# EasyEDA Pro project ProProject_TauKeyboard_2023-12-09.epro

# Schematic 61key
Create Date: 2023-12-01; Page Name: P1; Project Name: TauKeyboard; Schematic Name: 61key; Update Date: 2023-12-06; Company: 嘉立创EDA; Page Size: A3; Version: V1.0
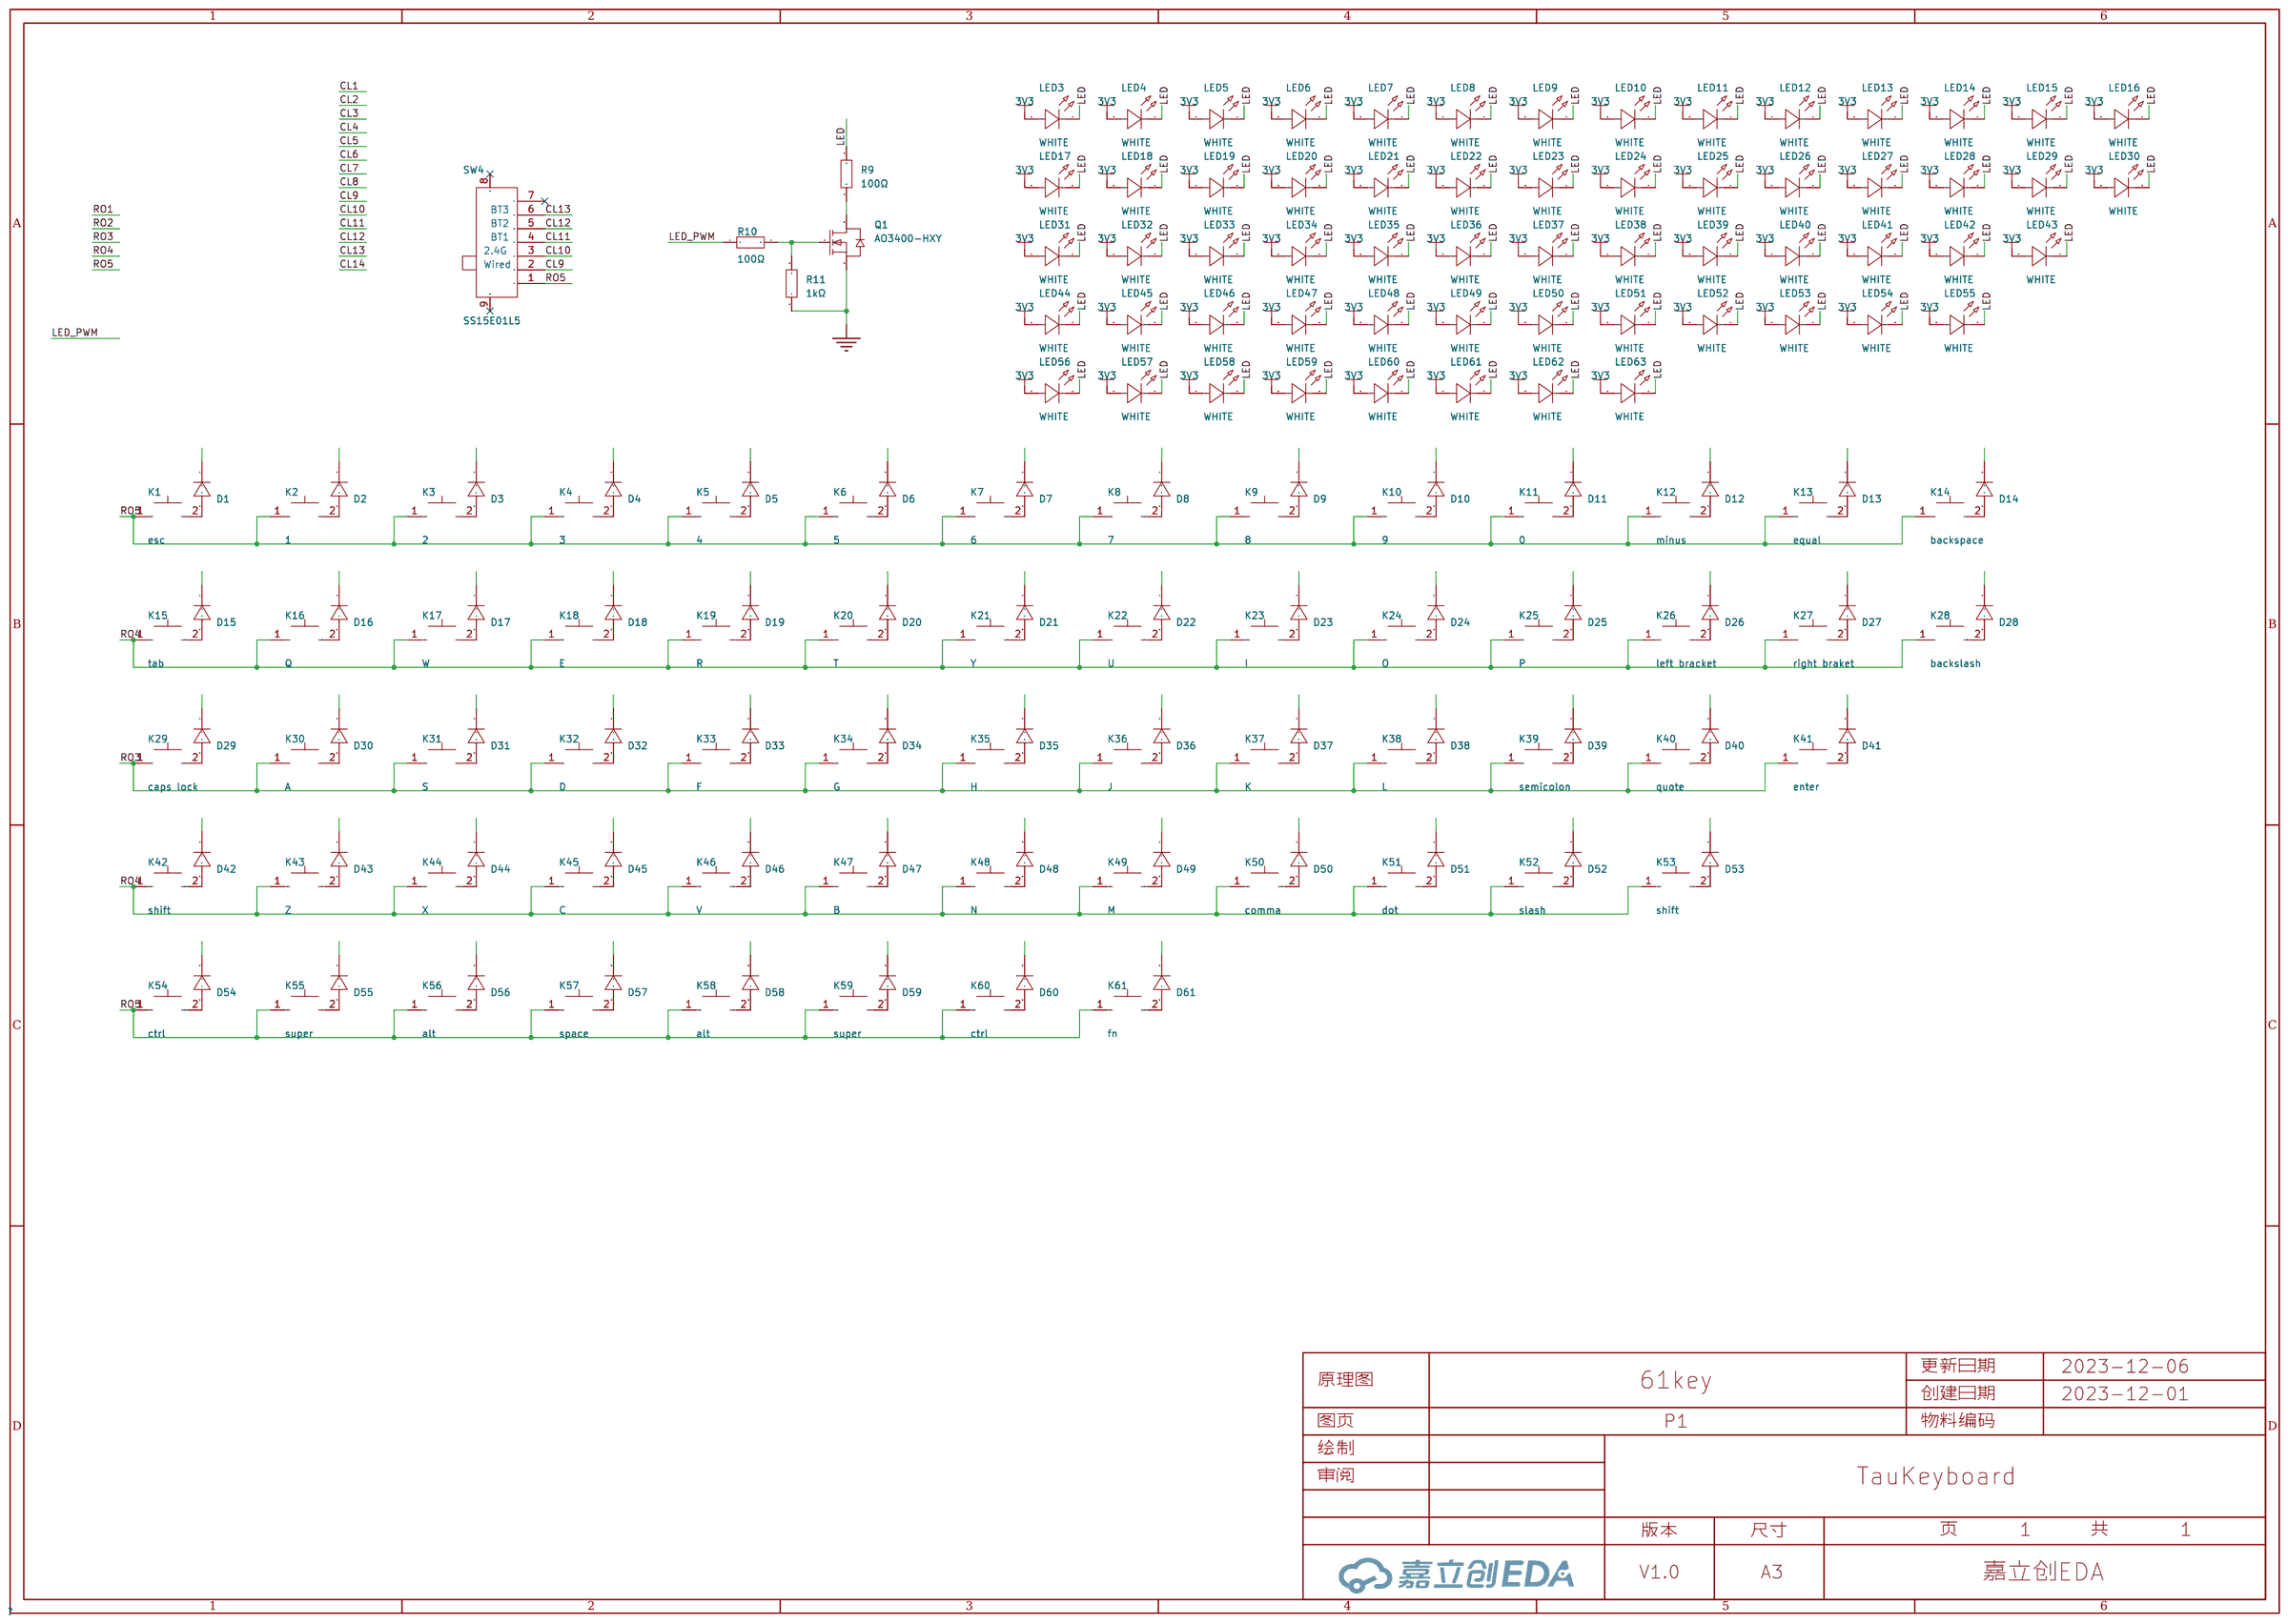
[diagram p0: schematic sheet]

## Parts
CBB1  -
D1  1N4148WS  [SOD-323_L1.8-W1.3-LS2.5-RD]
D2  1N4148WS  [SOD-323_L1.8-W1.3-LS2.5-RD]
D3  1N4148WS  [SOD-323_L1.8-W1.3-LS2.5-RD]
D4  1N4148WS  [SOD-323_L1.8-W1.3-LS2.5-RD]
D5  1N4148WS  [SOD-323_L1.8-W1.3-LS2.5-RD]
D6  1N4148WS  [SOD-323_L1.8-W1.3-LS2.5-RD]
D7  1N4148WS  [SOD-323_L1.8-W1.3-LS2.5-RD]
D8  1N4148WS  [SOD-323_L1.8-W1.3-LS2.5-RD]
D9  1N4148WS  [SOD-323_L1.8-W1.3-LS2.5-RD]
D10  1N4148WS  [SOD-323_L1.8-W1.3-LS2.5-RD]
D11  1N4148WS  [SOD-323_L1.8-W1.3-LS2.5-RD]
D12  1N4148WS  [SOD-323_L1.8-W1.3-LS2.5-RD]
D13  1N4148WS  [SOD-323_L1.8-W1.3-LS2.5-RD]
D14  1N4148WS  [SOD-323_L1.8-W1.3-LS2.5-RD]
D15  1N4148WS  [SOD-323_L1.8-W1.3-LS2.5-RD]
D16  1N4148WS  [SOD-323_L1.8-W1.3-LS2.5-RD]
D17  1N4148WS  [SOD-323_L1.8-W1.3-LS2.5-RD]
D18  1N4148WS  [SOD-323_L1.8-W1.3-LS2.5-RD]
D19  1N4148WS  [SOD-323_L1.8-W1.3-LS2.5-RD]
D20  1N4148WS  [SOD-323_L1.8-W1.3-LS2.5-RD]
D21  1N4148WS  [SOD-323_L1.8-W1.3-LS2.5-RD]
D22  1N4148WS  [SOD-323_L1.8-W1.3-LS2.5-RD]
D23  1N4148WS  [SOD-323_L1.8-W1.3-LS2.5-RD]
D24  1N4148WS  [SOD-323_L1.8-W1.3-LS2.5-RD]
D25  1N4148WS  [SOD-323_L1.8-W1.3-LS2.5-RD]
D26  1N4148WS  [SOD-323_L1.8-W1.3-LS2.5-RD]
D27  1N4148WS  [SOD-323_L1.8-W1.3-LS2.5-RD]
D28  1N4148WS  [SOD-323_L1.8-W1.3-LS2.5-RD]
D29  1N4148WS  [SOD-323_L1.8-W1.3-LS2.5-RD]
D30  1N4148WS  [SOD-323_L1.8-W1.3-LS2.5-RD]
D31  1N4148WS  [SOD-323_L1.8-W1.3-LS2.5-RD]
D32  1N4148WS  [SOD-323_L1.8-W1.3-LS2.5-RD]
D33  1N4148WS  [SOD-323_L1.8-W1.3-LS2.5-RD]
D34  1N4148WS  [SOD-323_L1.8-W1.3-LS2.5-RD]
D35  1N4148WS  [SOD-323_L1.8-W1.3-LS2.5-RD]
D36  1N4148WS  [SOD-323_L1.8-W1.3-LS2.5-RD]
D37  1N4148WS  [SOD-323_L1.8-W1.3-LS2.5-RD]
D38  1N4148WS  [SOD-323_L1.8-W1.3-LS2.5-RD]
D39  1N4148WS  [SOD-323_L1.8-W1.3-LS2.5-RD]
D40  1N4148WS  [SOD-323_L1.8-W1.3-LS2.5-RD]
D41  1N4148WS  [SOD-323_L1.8-W1.3-LS2.5-RD]
D42  1N4148WS  [SOD-323_L1.8-W1.3-LS2.5-RD]
D43  1N4148WS  [SOD-323_L1.8-W1.3-LS2.5-RD]
D44  1N4148WS  [SOD-323_L1.8-W1.3-LS2.5-RD]
D45  1N4148WS  [SOD-323_L1.8-W1.3-LS2.5-RD]
D46  1N4148WS  [SOD-323_L1.8-W1.3-LS2.5-RD]
D47  1N4148WS  [SOD-323_L1.8-W1.3-LS2.5-RD]
D48  1N4148WS  [SOD-323_L1.8-W1.3-LS2.5-RD]
D49  1N4148WS  [SOD-323_L1.8-W1.3-LS2.5-RD]
D50  1N4148WS  [SOD-323_L1.8-W1.3-LS2.5-RD]
D51  1N4148WS  [SOD-323_L1.8-W1.3-LS2.5-RD]
D52  1N4148WS  [SOD-323_L1.8-W1.3-LS2.5-RD]
D53  1N4148WS  [SOD-323_L1.8-W1.3-LS2.5-RD]
D54  1N4148WS  [SOD-323_L1.8-W1.3-LS2.5-RD]
D55  1N4148WS  [SOD-323_L1.8-W1.3-LS2.5-RD]
D56  1N4148WS  [SOD-323_L1.8-W1.3-LS2.5-RD]
D57  1N4148WS  [SOD-323_L1.8-W1.3-LS2.5-RD]
D58  1N4148WS  [SOD-323_L1.8-W1.3-LS2.5-RD]
D59  1N4148WS  [SOD-323_L1.8-W1.3-LS2.5-RD]
D60  1N4148WS  [SOD-323_L1.8-W1.3-LS2.5-RD]
D61  1N4148WS  [SOD-323_L1.8-W1.3-LS2.5-RD]
K1  esc  [SMD_KEYBOARD-SW]
K2  1  [SMD_KEYBOARD-SW]
K3  2  [SMD_KEYBOARD-SW]
K4  3  [SMD_KEYBOARD-SW]
K5  4  [SMD_KEYBOARD-SW]
K6  5  [SMD_KEYBOARD-SW]
K7  6  [SMD_KEYBOARD-SW]
K8  7  [SMD_KEYBOARD-SW]
K9  8  [SMD_KEYBOARD-SW]
K10  9  [SMD_KEYBOARD-SW]
K11  0  [SMD_KEYBOARD-SW]
K12  minus  [SMD_KEYBOARD-SW]
K13  equal  [SMD_KEYBOARD-SW]
K14  backspace  [SMD_KEYBOARD-SW]
K15  tab  [SMD_KEYBOARD-SW]
K16  Q  [SMD_KEYBOARD-SW]
K17  W  [SMD_KEYBOARD-SW]
K18  E  [SMD_KEYBOARD-SW]
K19  R  [SMD_KEYBOARD-SW]
K20  T  [SMD_KEYBOARD-SW]
K21  Y  [SMD_KEYBOARD-SW]
K22  U  [SMD_KEYBOARD-SW]
K23  I  [SMD_KEYBOARD-SW]
K24  O  [SMD_KEYBOARD-SW]
K25  P  [SMD_KEYBOARD-SW]
K26  left bracket  [SMD_KEYBOARD-SW]
K27  right braket  [SMD_KEYBOARD-SW]
K28  backslash  [SMD_KEYBOARD-SW]
K29  caps lock  [SMD_KEYBOARD-SW]
K30  A  [SMD_KEYBOARD-SW]
K31  S  [SMD_KEYBOARD-SW]
K32  D  [SMD_KEYBOARD-SW]
K33  F  [SMD_KEYBOARD-SW]
K34  G  [SMD_KEYBOARD-SW]
K35  H  [SMD_KEYBOARD-SW]
K36  J  [SMD_KEYBOARD-SW]
K37  K  [SMD_KEYBOARD-SW]
K38  L  [SMD_KEYBOARD-SW]
K39  semicolon  [SMD_KEYBOARD-SW]
K40  quote  [SMD_KEYBOARD-SW]
K41  enter  [SMD_KEYBOARD-SW]
K42  shift  [SMD_KEYBOARD-SW]
K43  Z  [SMD_KEYBOARD-SW]
K44  X  [SMD_KEYBOARD-SW]
K45  C  [SMD_KEYBOARD-SW]
K46  V  [SMD_KEYBOARD-SW]
K47  B  [SMD_KEYBOARD-SW]
K48  N  [SMD_KEYBOARD-SW]
K49  M  [SMD_KEYBOARD-SW]
K50  comma  [SMD_KEYBOARD-SW]
K51  dot  [SMD_KEYBOARD-SW]
K52  slash  [SMD_KEYBOARD-SW]
K53  shift  [SMD_KEYBOARD-SW]
K54  ctrl  [SMD_KEYBOARD-SW]
K55  super  [SMD_KEYBOARD-SW]
K56  alt  [SMD_KEYBOARD-SW]
K57  space  [SMD_KEYBOARD-SW]
K58  alt  [SMD_KEYBOARD-SW]
K59  super  [SMD_KEYBOARD-SW]
K60  ctrl  [SMD_KEYBOARD-SW]
K61  fn  [SMD_KEYBOARD-SW]
LED3  WHITE  [LED0603-RD]
LED4  WHITE  [LED0603-RD]
LED5  WHITE  [LED0603-RD]
LED6  WHITE  [LED0603-RD]
LED7  WHITE  [LED0603-RD]
LED8  WHITE  [LED0603-RD]
LED9  WHITE  [LED0603-RD]
LED10  WHITE  [LED0603-RD]
LED11  WHITE  [LED0603-RD]
LED12  WHITE  [LED0603-RD]
LED13  WHITE  [LED0603-RD]
LED14  WHITE  [LED0603-RD]
LED15  WHITE  [LED0603-RD]
LED16  WHITE  [LED0603-RD]
LED17  WHITE  [LED0603-RD]
LED18  WHITE  [LED0603-RD]
LED19  WHITE  [LED0603-RD]
LED20  WHITE  [LED0603-RD]
LED21  WHITE  [LED0603-RD]
LED22  WHITE  [LED0603-RD]
LED23  WHITE  [LED0603-RD]
LED24  WHITE  [LED0603-RD]
LED25  WHITE  [LED0603-RD]
LED26  WHITE  [LED0603-RD]
LED27  WHITE  [LED0603-RD]
LED28  WHITE  [LED0603-RD]
LED29  WHITE  [LED0603-RD]
LED30  WHITE  [LED0603-RD]
LED31  WHITE  [LED0603-RD]
LED32  WHITE  [LED0603-RD]
LED33  WHITE  [LED0603-RD]
LED34  WHITE  [LED0603-RD]
LED35  WHITE  [LED0603-RD]
LED36  WHITE  [LED0603-RD]
LED37  WHITE  [LED0603-RD]
LED38  WHITE  [LED0603-RD]
LED39  WHITE  [LED0603-RD]
LED40  WHITE  [LED0603-RD]
LED41  WHITE  [LED0603-RD]
LED42  WHITE  [LED0603-RD]
LED43  WHITE  [LED0603-RD]
LED44  WHITE  [LED0603-RD]
LED45  WHITE  [LED0603-RD]
LED46  WHITE  [LED0603-RD]
LED47  WHITE  [LED0603-RD]
LED48  WHITE  [LED0603-RD]
LED49  WHITE  [LED0603-RD]
LED50  WHITE  [LED0603-RD]
LED51  WHITE  [LED0603-RD]
LED52  WHITE  [LED0603-RD]
LED53  WHITE  [LED0603-RD]
LED54  WHITE  [LED0603-RD]
LED55  WHITE  [LED0603-RD]
LED56  WHITE  [LED0603-RD]
LED57  WHITE  [LED0603-RD]
LED58  WHITE  [LED0603-RD]
LED59  WHITE  [LED0603-RD]
LED60  WHITE  [LED0603-RD]
LED61  WHITE  [LED0603-RD]
LED62  WHITE  [LED0603-RD]
LED63  WHITE  [LED0603-RD]
Q1  AO3400-HXY  [SOT-23_L2.9-W1.3-P1.90-LS2.4-BR]
R9  100Ω  [R0603]
R10  100Ω  [R0603]
R11  1kΩ  [R0603]
SW4  SS15E01L5  [SW-TH_SS15E01L5]

## Library data of the parts
D1-D61 = 1N4148WS_C2128: 二极管配置:独立式;正向压降(Vf):1.25V@150mA;直流反向耐压(Vr):100V;平均整流电流(Io):150mA;功率:200mW;反向恢复时间(trr):4ns;; LCSC Part Name: 电压:100V 电流:150mA; Supplier Part: C2128; Manufacturer: CJ(江苏长电/长晶); Supplier Footprint: SOD-323; JLCPCB Part Class: 基础库; Datasheet: https://atta.szlcsc.com/upload/public/pdf/source/20140809/1457707208178.pdf; Supplier: LCSC; Diode Configuration: 独立式; Forward Voltage (Vf@If): 1.25V@150mA; Reverse Voltage (Vr): 100V; Average Rectified Current (Io): 150mA; Power Dissipation: 200mW; Reverse Leakage Current: 1uA@75V; Reverse Recovery Time (trr): 4ns; Operating Temperature: +150℃@(Tj)
K1-K61 = CPG151101S11-16: 轴类型:-;工作电压:2V~12V;针脚数:-;操作力:-;; Supplier Part: C5156480; Manufacturer: Kailh(凯华); JLCPCB Part Class: 扩展库; Datasheet: https://atta.szlcsc.com/upload/public/pdf/source/20220829/33DFC1A320A078D20879F2B21562B513.pdf; Supplier: LCSC; Operating Voltage: 2V~12V
LED3-LED63 = FC-1608W1-460: 发光颜色:白色;功率:72mW;透镜颜色:雾状黄透镜;发光强度:700mcd~1200mcd;发光角度:130°;工作温度:-30℃~+85℃;; LCSC Part Name: 发光二极管LED; Supplier Part: C19189747; Manufacturer: 国星光电; Supplier Footprint: 0603; Datasheet: https://atta.szlcsc.com/upload/public/pdf/source/20231122/B4E98198013F7ED2FCABE37C2DF5A061.pdf; Supplier: LCSC; Emitted Color: 白色; Forward Voltage (VF): 2.6V~3.6V; Forward Current: 20mA; Power Dissipation: 72mW; Lens Color: 雾状黄透镜; Luminous Intensity: 700mcd~1200mcd; Viewing Angle: 130°; Operating Temperature: -30℃~+85℃
Q1 = AO3400-HXY: 类型:N沟道;阈值电压(Vgs(th)@Id):1.4V@250uA;漏源电压(Vdss):30V;连续漏极电流(Id):5.8A;功率(Pd):1.4W;导通电阻(RDS(on)@Vgs,Id):28mΩ@10V,5.8A;; LCSC Part Name: N沟道 耐压:30V 电流:5.8A; Supplier Part: C4748804; Manufacturer: HXY MOSFET(华轩阳电子); Supplier Footprint: SOT-23; JLCPCB Part Class: 扩展库; Datasheet: https://atta.szlcsc.com/upload/public/pdf/source/20221216/C6CAAE960F4F5F0616BD2E5413E1C3AD.pdf; Supplier: LCSC; Type: N沟道; Gate Threshold Voltage (Vgs(th)@Id): 1.4V@250uA; Drain Source Voltage (Vdss): 30V; Continuous Drain Current (Id): 5.8A; Power Dissipation (Pd): 1.4W; Drain Source On Resistance (RDS(on)@Vgs,Id): 28mΩ@10V,5.8A; Input Capacitance (Ciss@Vds): 825pF@15V
R9 R10 = RC0603FR-07100RL: 电阻类型:厚膜电阻;阻值:100Ω;精度:±1%;功率:100mW;; LCSC Part Name: 100Ω ±1% 100mW; Supplier Part: C105588; Manufacturer: YAGEO(国巨); Supplier Footprint: 0603; JLCPCB Part Class: 扩展库; Datasheet: https://atta.szlcsc.com/upload/public/pdf/source/20170428/1493376742308.pdf; Supplier: LCSC; Type: 厚膜电阻; Tolerance: ±1%; Power(Watts): 100mW; Temperature Coefficient: ±100ppm/℃; Overload Voltage (Max): 75V; Operating Temperature Range: -55℃~+155℃
R11 = 0603WAF1001T5E: 阻值:1kΩ;精度:±1%;功率:100mW;温度系数:±100ppm/℃;电阻类型:厚膜电阻;; LCSC Part Name: 1kΩ ±1% 100mW 厚膜电阻; Supplier Part: C21190; Manufacturer: UNI-ROYAL(厚声); Supplier Footprint: 0603; JLCPCB Part Class: 基础库; Datasheet: https://atta.szlcsc.com/upload/public/pdf/source/20200306/C422600_1E6D84923E4A46A82E41ADD87F860B5C.pdf; Supplier: LCSC; Tolerance: ±1%; Power(Watts): 100mW; Overload Voltage (Max): 75V; Temperature Coefficient: ±100ppm/℃; Type: 厚膜电阻; Operating Temperature Range: -55℃~+155℃
SW4 = SS15E01L5: 额定电流(DC):300mA;额定电压(DC):50V;额定电流(AC):300mA;额定电压(AC):50V;电路结构:单刀五掷;安装方式:弯插;机械寿命:1万次;开关颜色:黑色;; LCSC Part Name: 柄长5mm 弯插五档 滑动开关 耐高温盐雾24小时绝缘油; Supplier Part: C1121868; Manufacturer: XKB Connectivity(中国星坤); Supplier Footprint: 插件; JLCPCB Part Class: 扩展库; Datasheet: https://atta.szlcsc.com/upload/public/pdf/source/20211009/6DB27A62802AC701819C0FDF2AF52303.pdf; Supplier: LCSC; Current Rating (DC): 300mA; Voltage Rating (DC): 50V; Current Rating (AC): 300mA; Voltage Rating (AC): 50V; Circuit: 单刀五掷; Mounting Style: 弯插; Mechanical Life: 1万次; Actuator Color: 黑色; Actuator Style: 矩形柱状; Pin Style: PC引脚; Operating Temperature: -40℃~+85℃; Switch Length: 22mm; Switch Width: 5.1mm; Switch Height: 7.4mm

## Nets
3V3: LED3.2(A) LED4.2(A) LED5.2(A) LED6.2(A) LED7.2(A) LED8.2(A) LED9.2(A) LED10.2(A) LED11.2(A) LED12.2(A) LED13.2(A) LED14.2(A) LED15.2(A) LED16.2(A) LED17.2(A) LED18.2(A) LED19.2(A) LED20.2(A) LED21.2(A) LED22.2(A) LED23.2(A) LED24.2(A) LED25.2(A) LED26.2(A) LED27.2(A) LED28.2(A) LED29.2(A) LED30.2(A) LED31.2(A) LED32.2(A) LED33.2(A) LED34.2(A) LED35.2(A) LED36.2(A) LED37.2(A) LED38.2(A) LED39.2(A) LED40.2(A) LED41.2(A) LED42.2(A) LED43.2(A) LED44.2(A) LED45.2(A) LED46.2(A) LED47.2(A) LED48.2(A) LED49.2(A) LED50.2(A) LED51.2(A) LED52.2(A) LED53.2(A) LED54.2(A) LED55.2(A) LED56.2(A) LED57.2(A) LED58.2(A) LED59.2(A) LED60.2(A) LED61.2(A) LED62.2(A) LED63.2(A)
GND: Q1.2(S) R11.1
CL1: CBB1.(PB0) K1.1 K2.1 K3.1 K4.1 K5.1 K6.1 K7.1 K8.1 K9.1 K10.1 K11.1 K12.1 K13.1 K14.1 K15.1 K16.1 K17.1 K18.1 K19.1 K20.1 K21.1 K22.1 K23.1 K24.1 K25.1 K26.1 K27.1 K28.1 K29.1 K30.1 K31.1 K32.1 K33.1 K34.1 K35.1 K36.1 K37.1 K38.1 K39.1 K40.1 K41.1 K42.1 K43.1 K44.1 K45.1 K46.1 K47.1 K48.1 K49.1 K50.1 K51.1 K52.1 K53.1 K54.1 K55.1 K56.1 K57.1 K58.1 K59.1 K60.1 K61.1 R10.1 SW4.1 SW4.2 SW4.3 SW4.4 SW4.5 SW4.6
LED: LED3.1(K) LED4.1(K) LED5.1(K) LED6.1(K) LED7.1(K) LED8.1(K) LED9.1(K) LED10.1(K) LED11.1(K) LED12.1(K) LED13.1(K) LED14.1(K) LED15.1(K) LED16.1(K) LED17.1(K) LED18.1(K) LED19.1(K) LED20.1(K) LED21.1(K) LED22.1(K) LED23.1(K) LED24.1(K) LED25.1(K) LED26.1(K) LED27.1(K) LED28.1(K) LED29.1(K) LED30.1(K) LED31.1(K) LED32.1(K) LED33.1(K) LED34.1(K) LED35.1(K) LED36.1(K) LED37.1(K) LED38.1(K) LED39.1(K) LED40.1(K) LED41.1(K) LED42.1(K) LED43.1(K) LED44.1(K) LED45.1(K) LED46.1(K) LED47.1(K) LED48.1(K) LED49.1(K) LED50.1(K) LED51.1(K) LED52.1(K) LED53.1(K) LED54.1(K) LED55.1(K) LED56.1(K) LED57.1(K) LED58.1(K) LED59.1(K) LED60.1(K) LED61.1(K) LED62.1(K) LED63.1(K) R9.2
Net-(D1-2): D1.2(A) K1.2
Net-(D2-2): D2.2(A) K2.2
Net-(D3-2): D3.2(A) K3.2
Net-(D4-2): D4.2(A) K4.2
Net-(D5-2): D5.2(A) K5.2
Net-(D6-2): D6.2(A) K6.2
Net-(D7-2): D7.2(A) K7.2
Net-(D8-2): D8.2(A) K8.2
Net-(D9-2): D9.2(A) K9.2
Net-(D10-2): D10.2(A) K10.2
Net-(D11-2): D11.2(A) K11.2
Net-(D12-2): D12.2(A) K12.2
Net-(D13-2): D13.2(A) K13.2
Net-(D14-2): D14.2(A) K14.2
Net-(D15-2): D15.2(A) K15.2
Net-(D16-2): D16.2(A) K16.2
Net-(D17-2): D17.2(A) K17.2
Net-(D18-2): D18.2(A) K18.2
Net-(D19-2): D19.2(A) K19.2
Net-(D20-2): D20.2(A) K20.2
Net-(D21-2): D21.2(A) K21.2
Net-(D22-2): D22.2(A) K22.2
Net-(D23-2): D23.2(A) K23.2
Net-(D24-2): D24.2(A) K24.2
Net-(D25-2): D25.2(A) K25.2
Net-(D26-2): D26.2(A) K26.2
Net-(D27-2): D27.2(A) K27.2
Net-(D28-2): D28.2(A) K28.2
Net-(D29-2): D29.2(A) K29.2
Net-(D30-2): D30.2(A) K30.2
Net-(D31-2): D31.2(A) K31.2
Net-(D32-2): D32.2(A) K32.2
Net-(D33-2): D33.2(A) K33.2
Net-(D34-2): D34.2(A) K34.2
Net-(D35-2): D35.2(A) K35.2
Net-(D36-2): D36.2(A) K36.2
Net-(D37-2): D37.2(A) K37.2
Net-(D38-2): D38.2(A) K38.2
Net-(D39-2): D39.2(A) K39.2
Net-(D40-2): D40.2(A) K40.2
Net-(D41-2): D41.2(A) K41.2
Net-(D42-2): D42.2(A) K42.2
Net-(D43-2): D43.2(A) K43.2
Net-(D44-2): D44.2(A) K44.2
Net-(D45-2): D45.2(A) K45.2
Net-(D46-2): D46.2(A) K46.2
Net-(D47-2): D47.2(A) K47.2
Net-(D48-2): D48.2(A) K48.2
Net-(D49-2): D49.2(A) K49.2
Net-(D50-2): D50.2(A) K50.2
Net-(D51-2): D51.2(A) K51.2
Net-(D52-2): D52.2(A) K52.2
Net-(D53-2): D53.2(A) K53.2
Net-(D54-2): D54.2(A) K54.2
Net-(D55-2): D55.2(A) K55.2
Net-(D56-2): D56.2(A) K56.2
Net-(D57-2): D57.2(A) K57.2
Net-(D58-2): D58.2(A) K58.2
Net-(D59-2): D59.2(A) K59.2
Net-(D60-2): D60.2(A) K60.2
Net-(D61-2): D61.2(A) K61.2
Net-(Q1-1): Q1.1(G) R10.2 R11.2
Net-(Q1-3): Q1.3(D) R9.1

Not connected (* = marked no-connect by the designer): D1 1(K); D2 1(K); D3 1(K); D4 1(K); D5 1(K); D6 1(K); D7 1(K); D8 1(K); D9 1(K); D10 1(K); D11 1(K); D12 1(K); D13 1(K); D14 1(K); D15 1(K); D16 1(K); D17 1(K); D18 1(K); D19 1(K); D20 1(K); D21 1(K); D22 1(K); D23 1(K); D24 1(K); D25 1(K); D26 1(K); D27 1(K); D28 1(K); D29 1(K); D30 1(K); D31 1(K); D32 1(K); D33 1(K); D34 1(K); D35 1(K); D36 1(K); D37 1(K); D38 1(K); D39 1(K); D40 1(K); D41 1(K); D42 1(K); D43 1(K); D44 1(K); D45 1(K); D46 1(K); D47 1(K); D48 1(K); D49 1(K); D50 1(K); D51 1(K); D52 1(K); D53 1(K); D54 1(K); D55 1(K); D56 1(K); D57 1(K); D58 1(K); D59 1(K); D60 1(K); D61 1(K); SW4 7* 8* 9*

## Notes on the sheet
- BT3
- BT1
- BT2
- 2.4G
- Wired

# Schematic 87key
Create Date: 2023-12-06; Page Name: P1; Project Name: TauKeyboard; Schematic Name: 87key; Update Date: 2023-12-06; Company: 嘉立创EDA; Page Size: A4; Version: V1.0
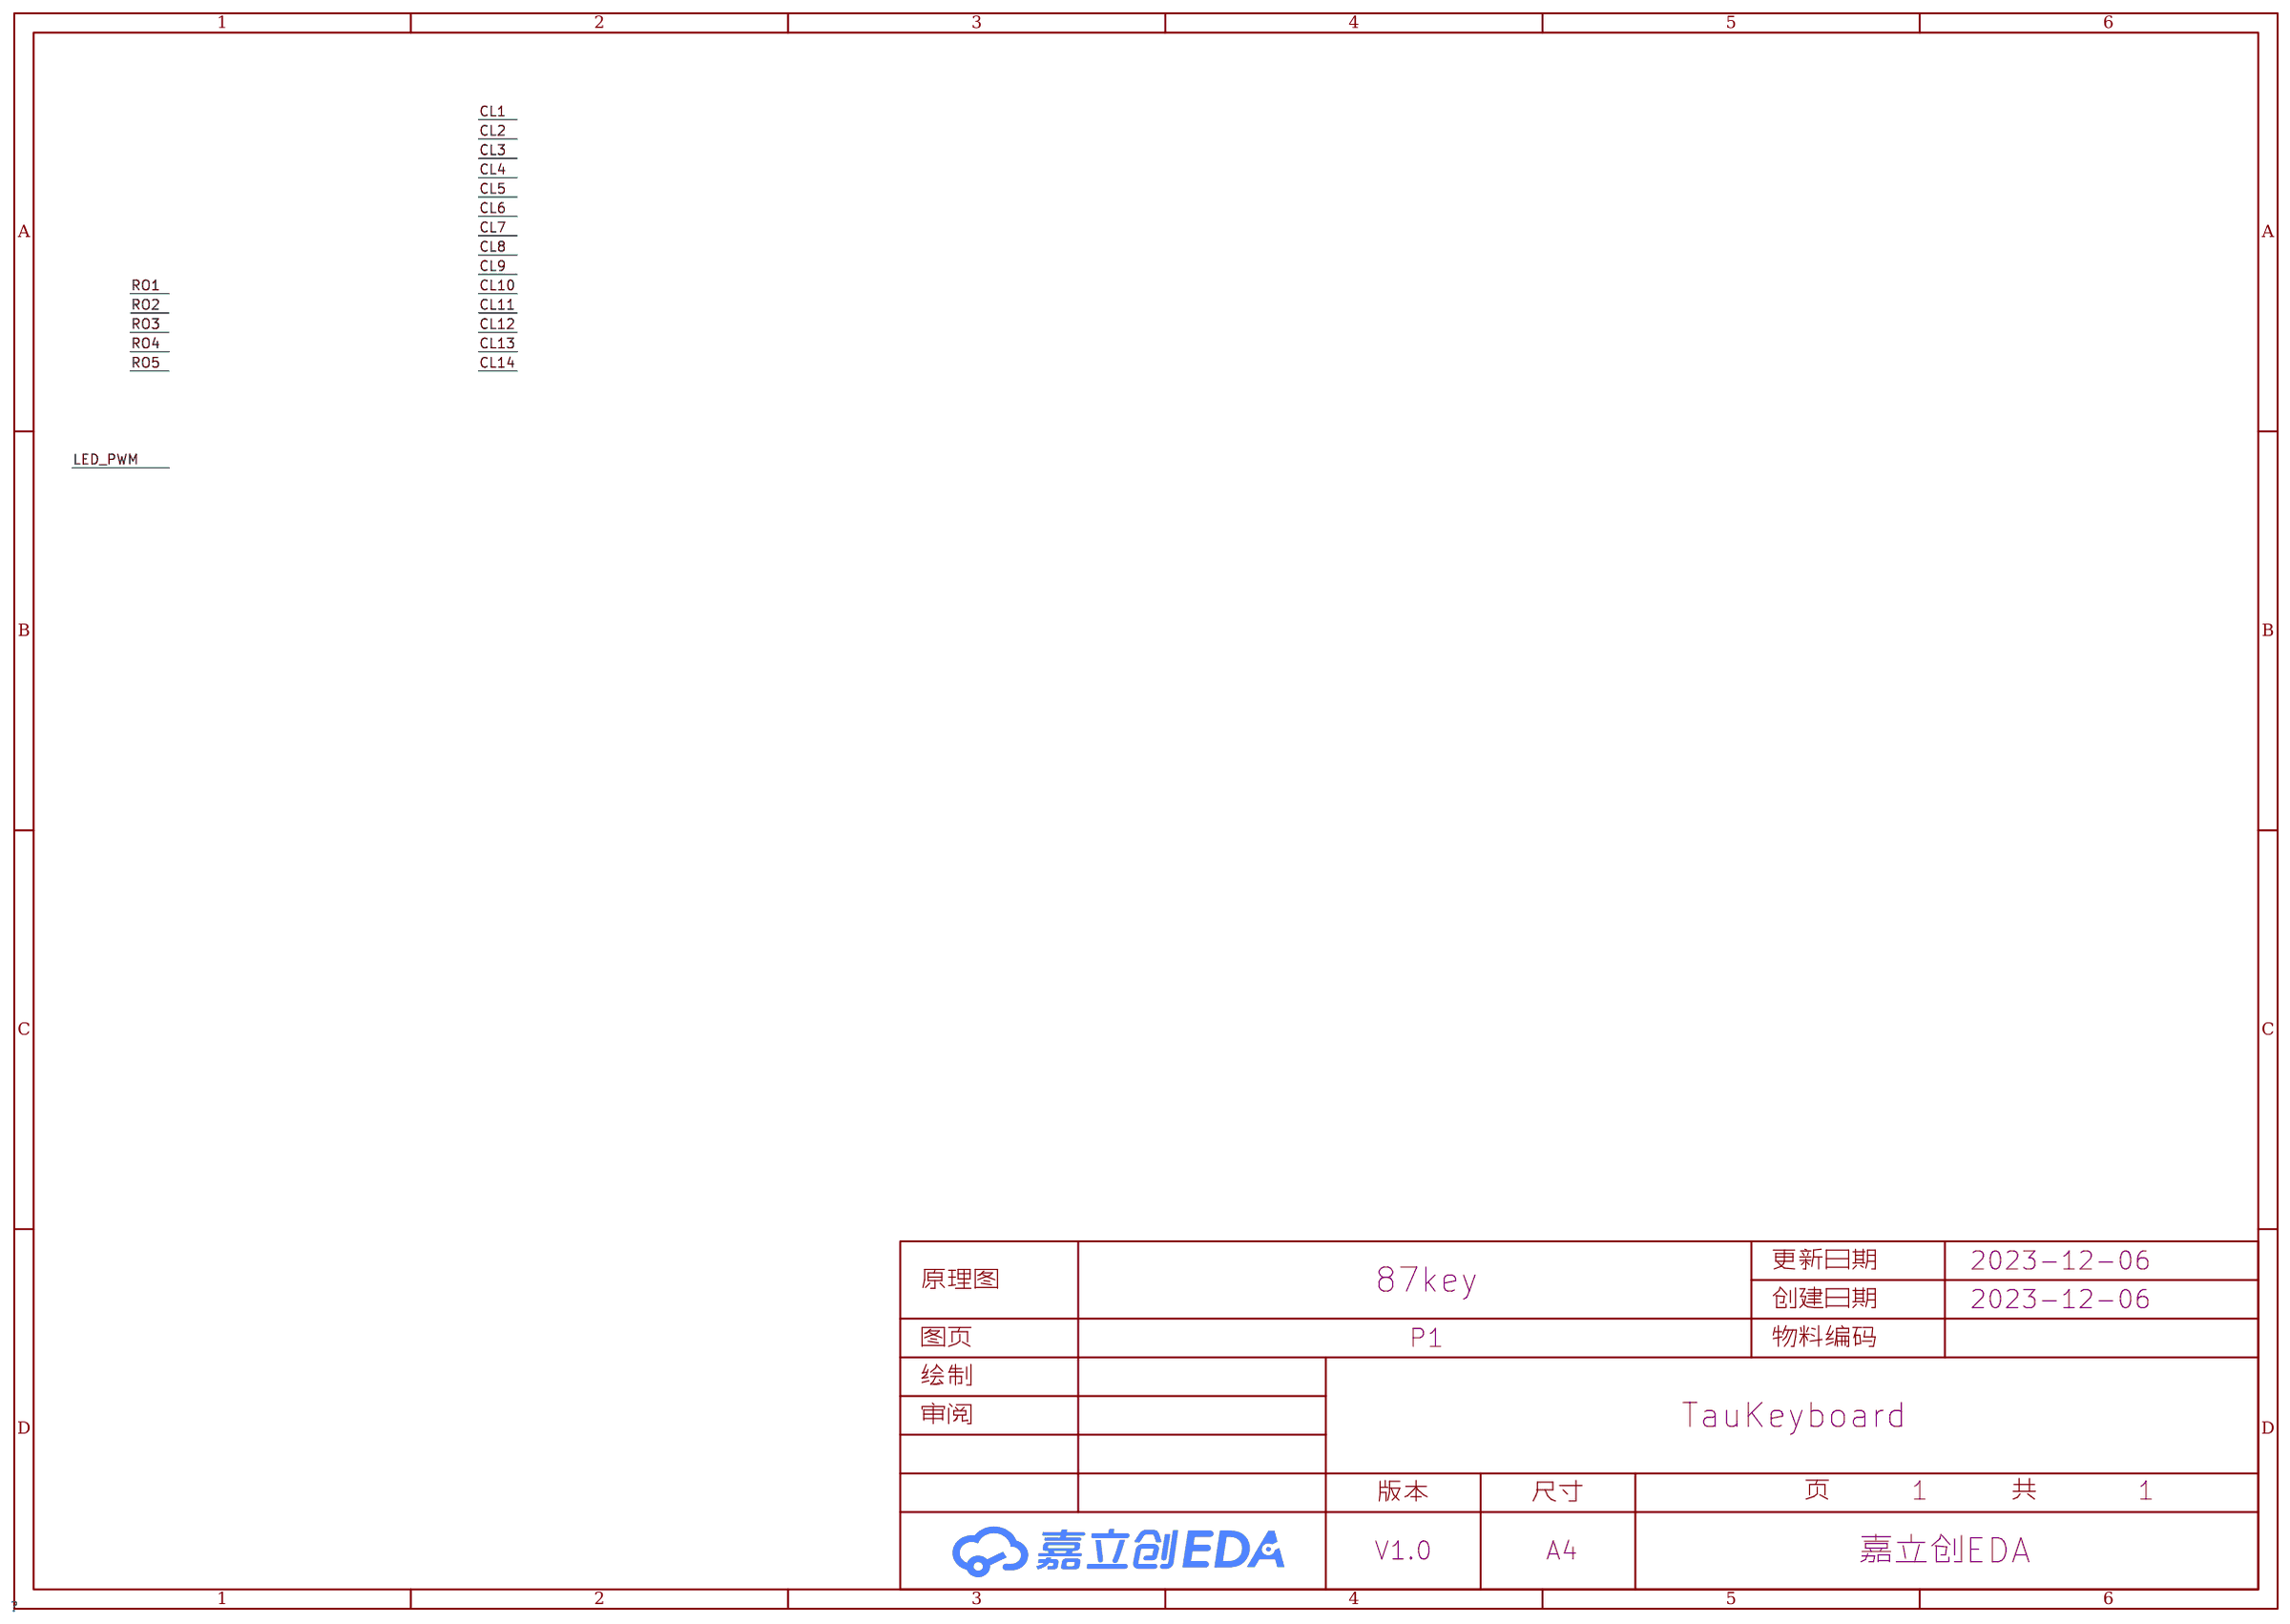
[diagram p1: schematic sheet]

## Parts
CBB1  -

## Nets
CL1: CBB1.(PB0)

# Schematic KeyboardCore
Create Date: 2023-12-06; Page Name: P1; Project Name: TauKeyboard; Schematic Name: KeyboardCore; Update Date: 2023-12-06; Company: 嘉立创EDA; Page Size: A4; Version: V1.0
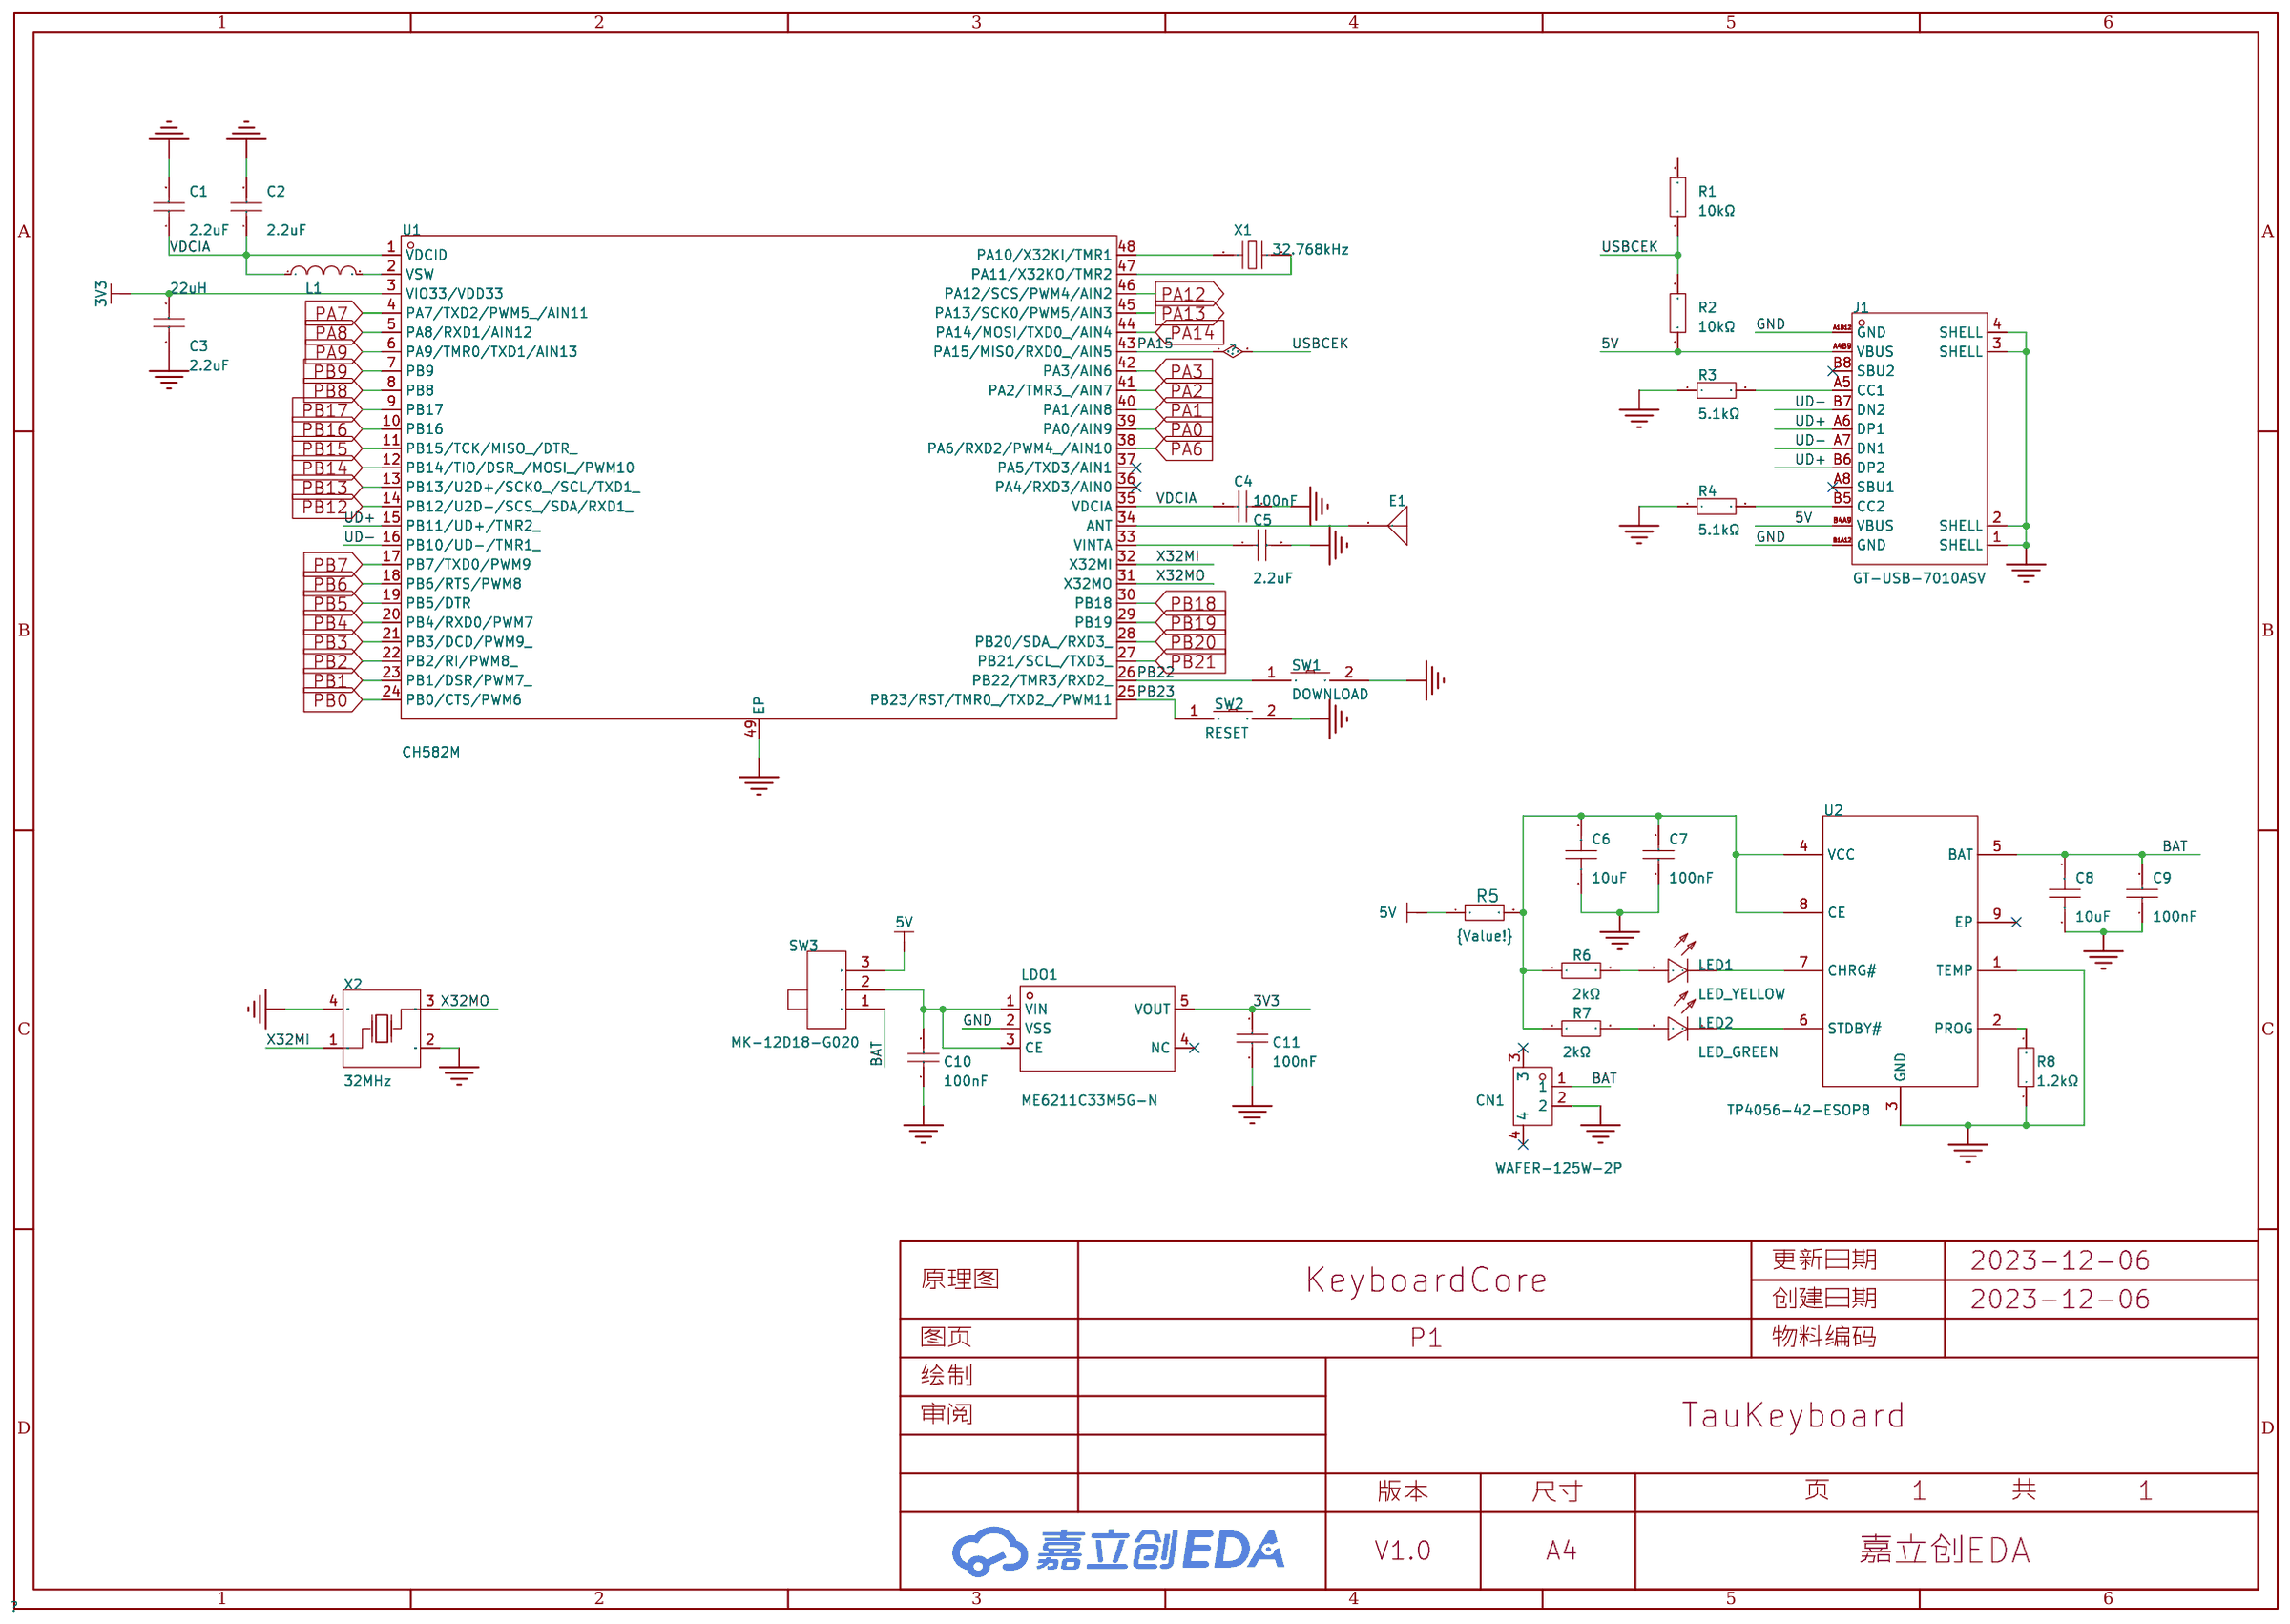
[diagram p2: schematic sheet]

## Parts
C1  2.2uF  [C0603]
C2  2.2uF  [C0603]
C3  2.2uF  [C0603]
C4  100nF  [C0603]
C5  2.2uF  [C0603]
C6  10uF  [C0805]
C7  100nF  [C0603]
C8  10uF  [C0805]
C9  100nF  [C0603]
C10  100nF  [C0603]
C11  100nF  [C0603]
CN1  WAFER-125W-2P  [CONN-SMD_WAFER-125W-2P]
E1  -  [Onboard Antenna]
J1  GT-USB-7010ASV  [USB-C-SMD_G-SWITCH_GT-USB-7010ASV]
L1  22uH  [IND-SMD_L3.0-W3.0_FNR30XXS]
LDO1  ME6211C33M5G-N  [SOT-23-5_L3.0-W1.7-P0.95-LS2.8-BL]
LED1  LED_YELLOW  [LED0603-RD]
LED2  LED_GREEN  [LED0603-RD]
R1  10kΩ  [R0603]
R2  10kΩ  [R0603]
R3  5.1kΩ  [R0603]
R4  5.1kΩ  [R0603]
R5  -  [R2010]
R6  2kΩ  [R0603]
R7  2kΩ  [R0603]
R8  1.2kΩ  [R0603]
SW1  DOWNLOAD  [SW-SMD_L6.0-W3.3-LS8.0]
SW2  RESET  [SW-SMD_L6.0-W3.3-LS8.0]
SW3  MK-12D18-G020  [SW-TH_MK-12D18-G040]
U1  CH582M  [QFN-48_L5.0-W5.0-P0.35-BL-EP]
U2  TP4056-42-ESOP8  [ESOP-8_L4.9-W3.9-P1.27-LS6.0-BL-EP]
X1  32.768kHz  [OSC-SMD_L3.2-W1.5]
X2  32MHz  [CRYSTAL-SMD_4P-L3.2-W2.5-BL]

## Library data of the parts
C1-C3 C5 = 0603B225K250NT: 容值:2.2uF;精度:±10%;额定电压:25V;材质(温度系数):X7R;; LCSC Part Name: 2.2uF ±10% 25V; Supplier Part: C99228; Manufacturer: FH(风华); Supplier Footprint: 0603; Datasheet: https://atta.szlcsc.com/upload/public/pdf/source/20200305/C486355_26A10D38EF8C2A5C37091D0039909270.pdf; Supplier: LCSC; Tolerance: ±10%; Voltage Rated: 25V; Temperature Coefficient: X7R
C4 C7 C9-C11 = 0603B104K500NT: 容值:100nF;精度:±10%;额定电压:50V;材质(温度系数):X7R;; LCSC Part Name: 100nF ±10% 50V; Supplier Part: C30926; Manufacturer: FH(风华); Supplier Footprint: 0603; Datasheet: https://atta.szlcsc.com/upload/public/pdf/source/20200305/C486355_26A10D38EF8C2A5C37091D0039909270.pdf; Supplier: LCSC; Tolerance: ±10%; Voltage Rated: 50V; Temperature Coefficient: X7R
C6 C8 = 0805B106K100NT: 容值:10uF;精度:±10%;额定电压:10V;材质(温度系数):X7R;; LCSC Part Name: 10uF ±10% 10V; Supplier Part: C90544; Manufacturer: FH(风华); Supplier Footprint: 0805; JLCPCB Part Class: 扩展库; Datasheet: https://atta.szlcsc.com/upload/public/pdf/source/20200305/C486355_26A10D38EF8C2A5C37091D0039909270.pdf; Supplier: LCSC; Tolerance: ±10%; Voltage Rated: 10V; Temperature Coefficient: X7R
CN1 = WAFER-125W-2P: 插针结构:1x2P;间距:1.25mm;公母:公;安装方式:卧贴;行距:-;排数:1;每排PIN数:2;参考系列:-;额定电流:1A;工作温度范围:-25℃~+85℃;; LCSC Part Name: 1x2P 间距:1.25mm 卧贴 加盖; Supplier Part: C2840410; Manufacturer: XUNPU(讯普); Supplier Footprint: SMD,P=1.25mm; JLCPCB Part Class: 扩展库; Datasheet: https://atta.szlcsc.com/upload/public/pdf/source/20210615/C2840410_FB15A9F825C8DEA13D8CE80985137CD1.pdf; Supplier: LCSC; Pins Structure: 1x2P; Pitch: 1.25mm; Gender: 公; Mounting Style: 卧贴; Number of Rows: 1; Number of PINs Per Row: 2; Current Rating (Max): 1A; Operating Temperature Range: -25℃~+85℃
E1 = Antenna
J1 = GT-USB-7010ASV: 连接器类型:Type-C;标准:USB 2.0;公母:母;触点数量:16P;端口数量:1;安装方式:卧贴;额定电流 - 电源:3A;触头材质:高导铜;触头镀层:金;工作温度范围:-40℃~+85℃;焊接温度(最大值):-;; LCSC Part Name: Type-C 母 卧贴; Supplier Part: C2988369; Manufacturer: G-Switch(品赞); Supplier Footprint: SMD; Datasheet: https://atta.szlcsc.com/upload/public/pdf/source/20230327/DF227B64686AC8FA0AD1775797F2C3F1.pdf; Supplier: LCSC; Connector Type: Type-C; Standard: USB 2.0; Gender: 母; Number of Contacts: 16P; Number of Ports: 1; Mounting Style: 卧贴; Current Rating - Power (Max): 3A; Contact Material: 高导铜; Contact Plating: 金; Operating Temperature Range: -40℃~+85℃
L1 = FNR3015S220MT: 电感值:22uH;精度:±20%;额定电流:690mA;饱和电流(Isat):680mA;; LCSC Part Name: 22uH ±20% 680mA; Supplier Part: C167761; Manufacturer: cjiang(长江微电); Supplier Footprint: SMD,3x3x1.5mm; Datasheet: https://atta.szlcsc.com/upload/public/pdf/source/20190327/C167925_9EFF0AABC4CA629C2CC95961DBF7D39D.pdf; Supplier: LCSC; Tolerance: ±20%; Rated Current: 690mA; DC Resistance (DCR): 598mΩ; Saturation Current (Isat): 680mA
LDO1 = ME6211C33M5G-N: 输出类型:固定;输出极性:正;最大输入电压:6V;输出电压:3.3V;输出电流:500mA;电源纹波抑制比(PSRR):70dB;; Supplier Part: C82942; Manufacturer: MICRONE(南京微盟); Supplier Footprint: SOT-23-5; Datasheet: https://atta.szlcsc.com/upload/public/pdf/source/20170918/C82942_1505727073070976520.pdf; Supplier: LCSC; Output Type: 固定; Output Polarity: 正; Number of Outputs: 1; Maximum Input Voltage: 6V; Output Voltage: 3.3V; Dropout Voltage: 260mV@(200mA); Output Current: 500mA; Power Supply Rejection Ratio (PSRR): 70dB
LED1 = NCD0603Y1: 发光颜色:黄色;功率:65mW;透镜颜色:无色透明;主波长:586nm~595nm;发光强度:80mcd~220mcd;发光角度:130°;工作温度:-30℃~+85℃;; LCSC Part Name: 黄灯 0603黄灯    正贴; Supplier Part: C84268; Manufacturer: 国星光电; Supplier Footprint: 0603; JLCPCB Part Class: 扩展库; Datasheet: https://atta.szlcsc.com/upload/public/pdf/source/20200820/C84268_8FC106CB292CF978F9CFC6892464F83C.pdf; Supplier: LCSC; Emitted Color: 黄色; Forward Voltage (VF): 1.6V~2.6V; Forward Current: 20mA; Power Dissipation: 65mW; Lens Color: 无色透明; Dominant Wavelength: 586nm~595nm; Luminous Intensity: 80mcd~220mcd; Viewing Angle: 130°; Operating Temperature: -30℃~+85℃
LED2 = NCD0603G1: 发光颜色:翠绿色;功率:72mW;透镜颜色:无色透明;主波长:515nm~530nm;发光强度:330mcd~900mcd;发光角度:130°;工作温度:-30℃~+85℃;; LCSC Part Name: 翠绿 0603翠绿  正贴; Supplier Part: C84267; Manufacturer: 国星光电; Supplier Footprint: 0603; JLCPCB Part Class: 扩展库; Datasheet: https://atta.szlcsc.com/upload/public/pdf/source/20200820/C84267_04BA7703640BAC111D09F5EFB971FBF3.pdf; Supplier: LCSC; Emitted Color: 翠绿色; Forward Voltage (VF): 2.6V~3.6V; Forward Current: 10mA; Power Dissipation: 72mW; Lens Color: 无色透明; Dominant Wavelength: 515nm~530nm; Luminous Intensity: 330mcd~900mcd; Viewing Angle: 130°; Operating Temperature: -30℃~+85℃
R1 R2 = RS-03K1002FT: 精度:±1%;温度系数:±100ppm/℃;阻值:10kΩ;功率:100mW;最大工作电压:50V;工作温度范围:-55℃~+155℃;; LCSC Part Name: 10KΩ(1002) ±1%; Supplier Part: C115324; Manufacturer: FH(风华); Supplier Footprint: 0603; Datasheet: https://atta.szlcsc.com/upload/public/pdf/source/20170704/1499151311434.pdf; Supplier: LCSC; Tolerance: ±1%; Temperature Coefficient: ±100ppm/℃; Power(Watts): 100mW; Overload Voltage (Max): 50V; Operating Temperature Range: -55℃~+155℃
R3 R4 = RS-03K5101FT: 阻值:5.1kΩ;精度:±1%;功率:100mW;温度系数:±100ppm/℃;; LCSC Part Name: 5.1kΩ ±1% 100mW; Supplier Part: C156350; Manufacturer: FH(风华); Supplier Footprint: 0603; Datasheet: https://atta.szlcsc.com/upload/public/pdf/source/20171221/C156350_15138396756901196077.pdf; Supplier: LCSC; Tolerance: ±1%; Power(Watts): 100mW; Temperature Coefficient: ±100ppm/℃; Overload Voltage (Max): 50V; Operating Temperature Range: -55℃~+155℃
R5 = RL2010JK-070R25L: Supplier Part: C326603; Manufacturer: YAGEO(国巨); Supplier Footprint: 2010; JLCPCB Part Class: 扩展库; Datasheet: https://atta.szlcsc.com/upload/public/pdf/source/20181031/C326603_1503002CEC664C73AF4D1DEAB37CC0DB.pdf; Supplier: LCSC
R6 R7 = RS-03K2001FT: 阻值:2kΩ;精度:±1%;功率:100mW;温度系数:±100ppm/℃;最大工作电压:50V;工作温度范围:-55℃~+155℃;; LCSC Part Name: 2kΩ ±1% 100mW; Supplier Part: C115336; Manufacturer: FH(风华); Supplier Footprint: 0603; JLCPCB Part Class: 扩展库; Datasheet: https://atta.szlcsc.com/upload/public/pdf/source/20170704/1499151313682.pdf; Supplier: LCSC; Tolerance: ±1%; Power(Watts): 100mW; Temperature Coefficient: ±100ppm/℃; Overload Voltage (Max): 50V; Operating Temperature Range: -55℃~+155℃
R8 = RC0603FR-071K2L: 电阻类型:厚膜电阻;阻值:1.2kΩ;精度:±1%;功率:100mW;; LCSC Part Name: 1.2kΩ ±1% 100mW; Supplier Part: C114605; Manufacturer: YAGEO(国巨); Supplier Footprint: 0603; JLCPCB Part Class: 扩展库; Datasheet: https://atta.szlcsc.com/upload/public/pdf/source/20170912/C114605_1505207784050963429.pdf; Supplier: LCSC; Type: 厚膜电阻; Tolerance: ±1%; Power(Watts): 100mW; Temperature Coefficient: ±100ppm/℃; Overload Voltage (Max): 75V; Operating Temperature Range: -55℃~+155℃
SW1 SW2 = TS-1101-C-W: 电路结构:单刀单掷;带支架:否;触点电流:50mA;额定电压(AC):-;额定电压(DC):12V;额定功率:-;安装方式:立贴;绝缘电阻:-;带灯:无;作用力:260gf;机械寿命:5万次;; LCSC Part Name: 6*3.6*2.5mm 立贴 轻触开关 白色带淡绿按键 卷装; Supplier Part: C318938; Manufacturer: XKB Connectivity(中国星坤); Supplier Footprint: SMD; JLCPCB Part Class: 扩展库; Datasheet: https://atta.szlcsc.com/upload/public/pdf/source/20200227/C318938_C2E53B1EEDE37D980A33616AC086DE53.pdf; Supplier: LCSC; Circuit: 单刀单掷; Actuator Style: 矩形按钮; Switch Length: 6mm; Switch Width: 3.6mm; Switch Height: 2.5mm; Strike Gundam: 否; Contact Current: 50mA; Voltage Rating (DC): 12V; Mounting Style: 立贴; Actuator/Cap Color: 白色带淡绿; With Lamp: 无; Operating Force: 260gf; Mechanical Life: 5万次; Operating Temperature: -30℃~+85℃
SW3 = MK-12D18-G020: LCSC Part Name: 边三脚微型拨动开关G4; Supplier Part: C3019727; Manufacturer: G-Switch(品赞); Supplier Footprint: 插件; Datasheet: https://atta.szlcsc.com/upload/public/pdf/source/20201201/C963202_825FB742C5BA766BED52E1DDA96DE5A3.pdf; Supplier: LCSC
U1 = CH582M: CPU内核:RISC-V;CPU最大主频:80MHz;工作电压范围:2.3V~3.6V;程序存储容量:512KB;程序存储器类型:FLASH;RAM总容量:32KB;GPIO端口数量:40;; Supplier Part: C2920766; Manufacturer: WCH(南京沁恒); Supplier Footprint: QFN-48-EP(5x5); JLCPCB Part Class: 扩展库; Datasheet: https://atta.szlcsc.com/upload/public/pdf/source/20220111/7785F6388C97C318998CCEA67CDD9164.pdf; Supplier: LCSC; CPU Core: RISC-V; CPU Maximum Speed: 80MHz; Operating Voltage Range: 2.3V~3.6V; Program Storage Size: 512KB; Program Memory Type: FLASH; RAM Size: 32KB; GPIO Ports Number: 40; ADC (Bit): 12bit; PWM (Bit): 26bit; 32Bit Timer: 4; UART/USART: 4; I2C: 1; SPI: 2; Operating Temperature Range: -40℃~+85℃
U2 = TP4056-42-ESOP8: 锂电池充电芯片; LCSC Part Name: TP4056-42-ESOP8 编带; Supplier Part: C16581; Manufacturer: TOPPOWER(南京拓微); Supplier Footprint: ESOP-8; JLCPCB Part Class: 扩展库; Datasheet: https://atta.szlcsc.com/upload/public/pdf/source/20160713/1468379849914.pdf; Supplier: LCSC
X1 = X321532768KGD2SI: 频率:32.768kHz;负载电容:12.5pF;频率公差:±20ppm;; LCSC Part Name: 32.768kHz ±20ppm 12.5pF YST310S; Supplier Part: C620155; Manufacturer: YXC(扬兴晶振); Supplier Footprint: SMD3215-2P; JLCPCB Part Class: 扩展库; Datasheet: https://atta.szlcsc.com/upload/public/pdf/source/20210329/C620155_E5A74FC0D27C5E9015A8D75DE9484FEA.pdf; Supplier: LCSC; Crystal Type: 贴片无源晶振; Load Capacitance: 12.5pF; Frequency Tolerance: ±20ppm; Operating Temperature: -40℃~+85℃
X2 = X322532MOB4SI: 频率:32MHz;负载电容:12pF;频率公差:±10ppm;; LCSC Part Name: 32MHz ±10ppm 12pF YSX321SL; Supplier Part: C9009; Manufacturer: YXC(扬兴晶振); Supplier Footprint: SMD3225-4P; Datasheet: https://atta.szlcsc.com/upload/public/pdf/source/20210329/C112971_1F611BDC486E193C1706F6D8EB5AA189.pdf; Supplier: LCSC; Crystal Type: 贴片无源晶振; Load Capacitance: 12pF; Frequency Tolerance: ±10ppm; Frequency Stability: ±30ppm; Operating Temperature: -40℃~+85℃

## Nets
3V3: C3.2 C11.2 LDO1.5(VOUT) U1.3(VIO33/VDD33)
5V: J1.A4B9(VBUS) J1.B4A9(VBUS) R2.1 R5.1 SW3.3
GND: C1.2 C2.2 C3.1 C4.2 C5.2 C6.1 C7.1 C8.1 C9.1 C10.1 C11.1 CN1.2 J1.1(SHELL) J1.2(SHELL) J1.3(SHELL) J1.4(SHELL) J1.A1B12(GND) J1.B1A12(GND) LDO1.2(VSS) R3.1 R4.1 R8.1 SW1.2 SW2.2 U1.49(EP) U2.1(TEMP) U2.3(GND) X2.2(GND) X2.4(GND)
BAT: C8.2 C9.2 CN1.1 SW3.1 U2.5(BAT)
PA0: U1.39(PA0/AIN9)
PA1: U1.40(PA1/AIN8)
PA2: U1.41(PA2/TMR3_/AIN7)
PA3: U1.42(PA3/AIN6)
PA6: U1.38(PA6/RXD2/PWM4_/AIN10)
PA7: U1.4(PA7/TXD2/PWM5_/AIN11)
PA8: U1.5(PA8/RXD1/AIN12)
PA9: U1.6(PA9/TMR0/TXD1/AIN13)
PA12: U1.46(PA12/SCS/PWM4/AIN2)
PA13: U1.45(PA13/SCK0/PWM5/AIN3)
PA14: U1.44(PA14/MOSI/TXD0_/AIN4)
PA15: R1.1 R2.2 U1.43(PA15/MISO/RXD0_/AIN5)
PB0: U1.24(PB0/CTS/PWM6)
PB1: U1.23(PB1/DSR/PWM7_)
PB2: U1.22(PB2/RI/PWM8_)
PB3: U1.21(PB3/DCD/PWM9_)
PB4: U1.20(PB4/RXD0/PWM7)
PB5: U1.19(PB5/DTR)
PB6: U1.18(PB6/RTS/PWM8)
PB7: U1.17(PB7/TXD0/PWM9)
PB8: U1.8(PB8)
PB9: U1.7(PB9)
PB12: U1.14(PB12/U2D-/SCS_/SDA/RXD1_)
PB13: U1.13(PB13/U2D+/SCK0_/SCL/TXD1_)
PB14: U1.12(PB14/TIO/DSR_/MOSI_/PWM10)
PB15: U1.11(PB15/TCK/MISO_/DTR_)
PB16: U1.10(PB16)
PB17: U1.9(PB17)
PB18: U1.30(PB18)
PB19: U1.29(PB19)
PB20: U1.28(PB20/SDA_/RXD3_)
PB21: U1.27(PB21/SCL_/TXD3_)
PB22: SW1.1 U1.26(PB22/TMR3/RXD2_)
PB23: SW2.1 U1.25(PB23/RST/TMR0_/TXD2_/PWM11)
UD+: J1.A6(DP1) J1.B6(DP2) U1.15(PB11/UD+/TMR2_)
UD-: J1.A7(DN1) J1.B7(DN2) U1.16(PB10/UD-/TMR1_)
VDCIA: C1.1 C2.1 C4.1 L1.1 U1.1(VDCID) U1.35(VDCIA)
X32MI: U1.32(X32MI) X2.1(OSC1)
X32MO: U1.31(X32MO) X2.3(OSC2)
Net-(C5-1): C5.1 U1.33(VINTA)
Net-(C6-2): C6.2 C7.2 R5.2 R6.1 R7.1 U2.4(VCC) U2.8(CE)
Net-(C10-2): C10.2 LDO1.1(VIN) LDO1.3(CE) SW3.2
Net-(E1-1): E1.1(A) U1.34(ANT)
Net-(J1-A5): J1.A5(CC1) R3.2
Net-(J1-B5): J1.B5(CC2) R4.2
Net-(L1-2): L1.2 U1.2(VSW)
Net-(LED1-1): LED1.1(K) U2.7(CHRG#)
Net-(LED1-2): LED1.2(A) R6.2
Net-(LED2-1): LED2.1(K) U2.6(STDBY#)
Net-(LED2-2): LED2.2(A) R7.2
Net-(R8-2): R8.2 U2.2(PROG)
Net-(U1-47): U1.47(PA11/X32KO/TMR2) X1.1
Net-(U1-48): U1.48(PA10/X32KI/TMR1) X1.2

Not connected (* = marked no-connect by the designer): CN1 3* 4*; J1 A8(SBU1)* B8(SBU2)*; LDO1 4(NC)*; R1 2; U1 36(PA4/RXD3/AIN0)* 37(PA5/TXD3/AIN1)*; U2 9(EP)*
